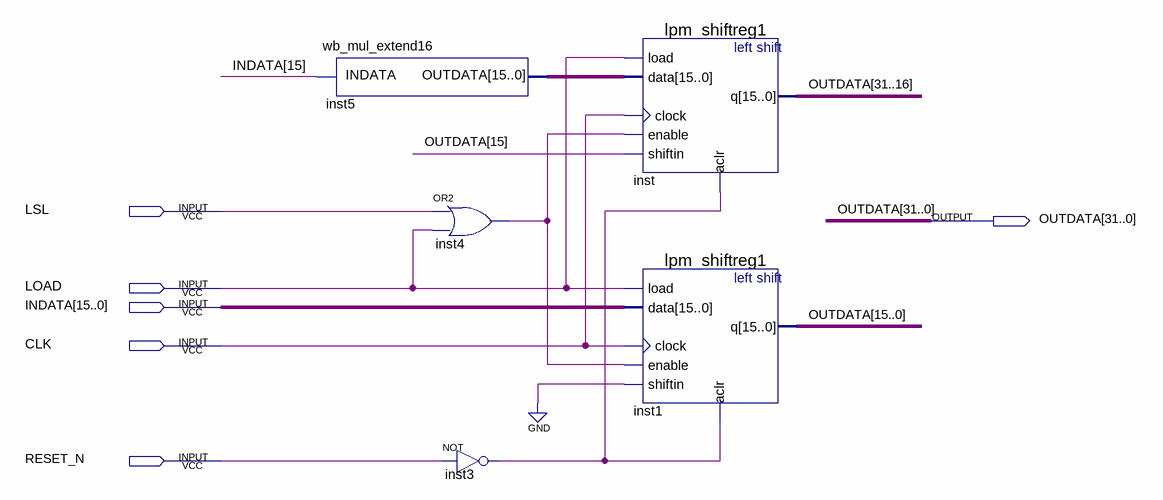
[diagram p0: schematic sheet]
// Quartus schematic wb_mul_shiftreg32left.bdf as structural Verilog: 5 symbols, 6 pins
module wb_mul_shiftreg32left (
  input  LSL,
  input  LOAD,
  input  [15:0] INDATA,
  input  CLK,
  input  RESET_N,
  output [31:0] OUTDATA
);

  wire inst3_out, inst4_out;
  wire [15:0] inst5_outdata;

  wb_mul_extend16 inst5 (.INDATA(INDATA[15]), .OUTDATA(inst5_outdata));
  or inst4 (inst4_out, LSL, LOAD);
  not inst3 (inst3_out, RESET_N);
  lpm_shiftreg1 inst (
    .load(LOAD), .data(inst5_outdata), .clock(CLK), .enable(inst4_out), .shiftin(OUTDATA[15]),
    .aclr(inst3_out), .q(OUTDATA[31:16]));
  lpm_shiftreg1 inst1 (
    .load(LOAD), .data(INDATA), .clock(CLK), .enable(inst4_out), .shiftin(1'b0), .aclr(inst3_out),
    .q(OUTDATA[15:0]));
endmodule
